# EAGLE design indsensor3 (EAGLE 7.1.0)
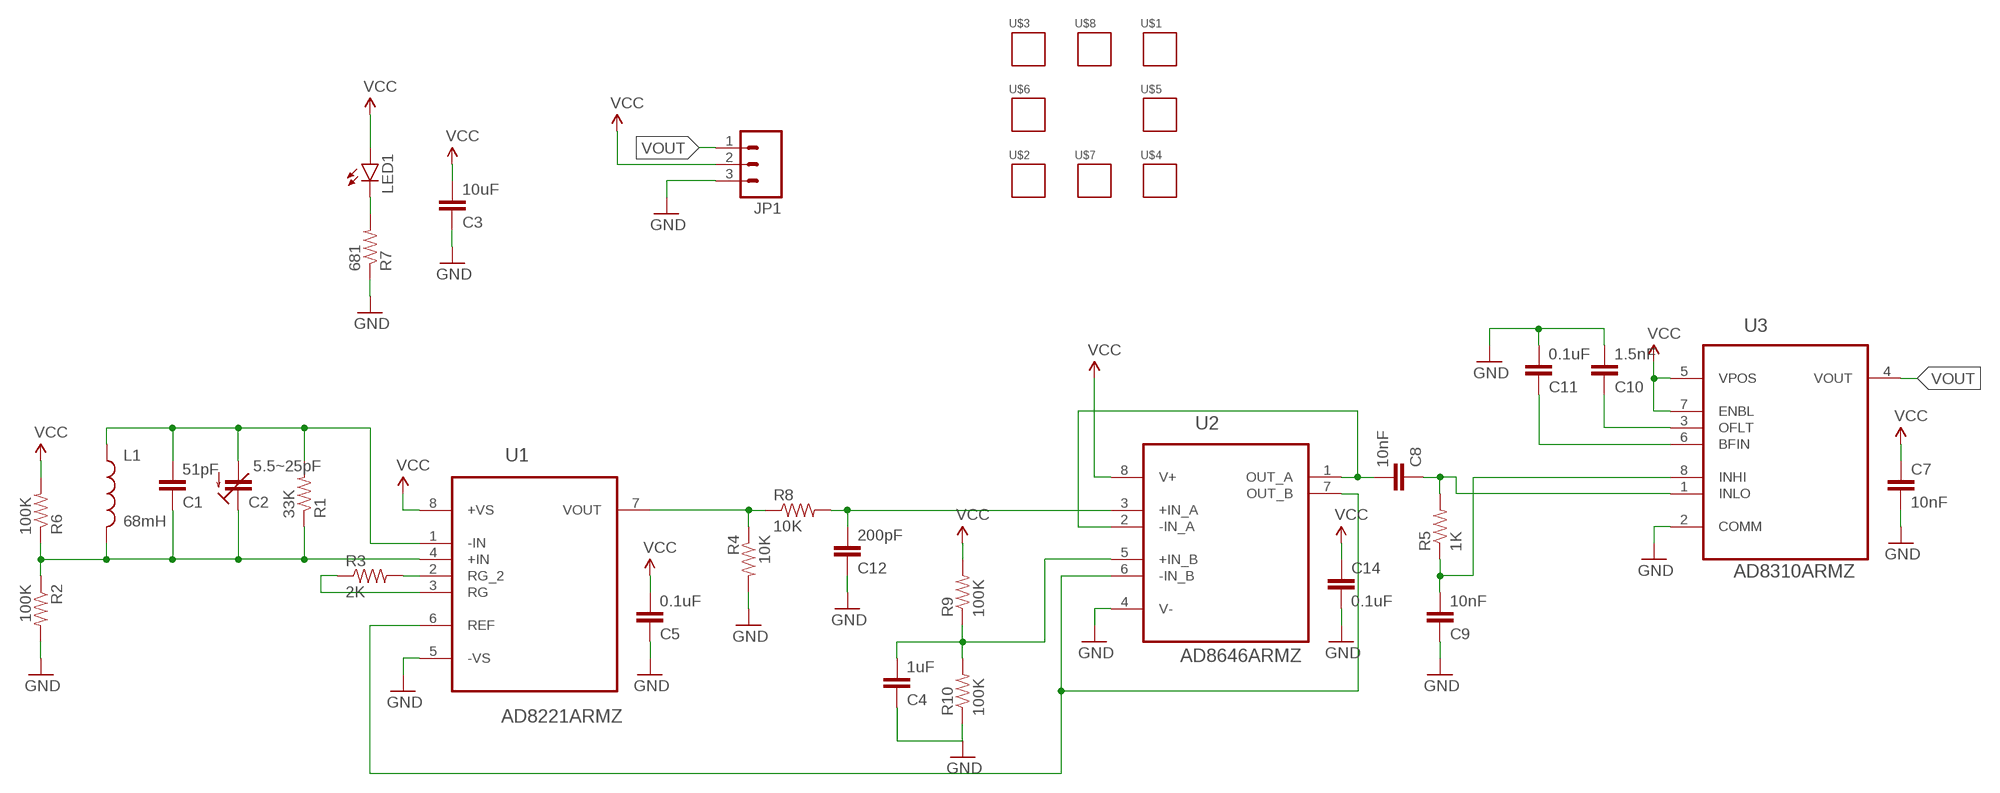
[diagram p0: schematic, sheet 1]

## Parts
C1  51pF  CAP0603-CAP  [0603-CAP]
C2  5.5~25pF  TRIMCAP-TZY  [TRIMCAP-TZY]
C3  10uF  CAP1206  [1206]
C4  1uF  CAP0603-CAP  [0603-CAP]
C5  0.1uF  CAP0603-CAP  [0603-CAP]
C7  10nF  CAP0603-CAP  [0603-CAP]
C8  10nF  CAP0603-CAP  [0603-CAP]
C9  10nF  CAP0603-CAP  [0603-CAP]
C10  1.5nF  CAP0603-CAP  [0603-CAP]
C11  0.1uF  CAP0603-CAP  [0603-CAP]
C12  200pF  CAP0603-CAP  [0603-CAP]
C14  0.1uF  CAP0603-CAP  [0603-CAP]
JP1  M03LOCK  [1X03_LOCK]
L1  68mH  INDUCTORRLB0912  [RLB0912]
LED1  LED0603  [LED-0603]
R1  33K  RESISTOR0603  [0603-RES]
R2  100K  RESISTOR0603  [0603-RES]
R3  2K  RESISTOR0603  [0603-RES]
R4  10K  RESISTOR0603  [0603-RES]
R5  1K  RESISTOR0603  [0603-RES]
R6  100K  RESISTOR0603  [0603-RES]
R7  681  RESISTOR0603  [0603-RES]
R8  10K  RESISTOR0603  [0603-RES]
R9  100K  RESISTOR0603  [0603-RES]
R10  100K  RESISTOR0603  [0603-RES]
U1  AD8221ARMZ  [SOP65P490X110-8N]
U2  AD8646ARMZ  [SOP65P490X110-8N]
U3  AD8310ARMZ  [SOP65P490X110-8N]
U$1  SHIELD-CORNER  [SHIELD-CORNER]
U$2  SHIELD-CORNER  [SHIELD-CORNER]
U$3  SHIELD-CORNER  [SHIELD-CORNER]
U$4  SHIELD-CORNER  [SHIELD-CORNER]
U$5  SHIELD-MIDDLE  [SHIELD-MIDDLE]
U$6  SHIELD-MIDDLE  [SHIELD-MIDDLE]
U$7  SHIELD-MIDDLEPART  [SHIELD-MIDDLEPART]
U$8  SHIELD-MIDDLE3  [SHIELD-MIDDLE3]

## Nets
10NF: R4.1 R8.1 U1.7(VOUT)
GND: C3.1 C4.1 C5.1 C7.2 C9.1 C10.2 C11.2 C12.1 C14.2 JP1.3 R2.2 R4.2 R7.1 R10.1 U1.5(-VS) U2.4(V-) U3.2(COMM)
N$1: R3.2 U1.2(RG_2)
N$2: R3.1 U1.3(RG)
N$3: C10.1 U3.3(OFLT)
N$4: C8.1 R5.2 U3.1(INLO)
N$5: C9.2 R5.1 U3.8(INHI)
N$6: LED1.C R7.2
N$7: C1.1 C2.2(E) L1.2 R1.1 R2.1 R6.1 U1.4(+IN)
N$8: C11.1 U3.6(BFIN)
N$9: C8.2 U2.1(OUT_A) U2.2(-IN_A)
N$10: C1.2 C2.1(A) L1.1 R1.2 U1.1(-IN)
N$11: C12.2 R8.2 U2.3(+IN_A)
N$12: U1.6(REF) U2.6(-IN_B) U2.7(OUT_B)
N$13: C4.2 R9.1 R10.2 U2.5(+IN_B)
VCC: C3.2 C5.2 C7.1 C14.1 JP1.2 LED1.A R6.2 R9.2 U1.8(+VS) U2.8(V+) U3.5(VPOS) U3.7(ENBL)
VOUT: JP1.1 U3.4(VOUT)

## Library data of the parts
C1 C4 C5 C7-C12 C14 = SparkFun-Capacitors:CAP: Capacitor Standard 0603 ceramic capacitor, and 0.1" leaded capacitor.
C2 = Custom:TRIMCAP-TZY
C3 = SparkFun-Passives:CAP: Capacitor Standard 0603 ceramic capacitor, and 0.1" leaded capacitor.
JP1 = SparkFun-Connectors:M03: Header 3 Standard 3-pin 0.1" header. Use with straight break away headers (SKU : PRT-00116), right angle break away headers (PRT-00553), swiss pins (PRT-00743), machine pins (PRT-00117), and female headers (PRT-00115). Molex polarized connector foot print use with SKU : PRT-08232 with associated crimp pins and housings.
L1 = SparkFun-Passives:INDUCTOR: Inductors Basic Inductor/Choke - 0603 and 1206. Footprints are not proven and vary greatly between part numbers. SRN6045- 33uH, 20% 1.4A SDR0403-560KL - 56uH, 10%, 500mA RMS/740mA peak
LED1 = SparkFun-LED:LED: LEDs Standard schematic elements and footprints for 5mm, 3mm, 1206, and 0603 sized LEDs. 5mm - Spark Fun Electronics SKU : COM-00529 (and others)
R1-R10 = SparkFun-Resistors:RESISTOR: Resistor Basic schematic elements and footprints for 0603, 1206, and PTH resistors.
U1 = Analog Devices_By_element14_Batch_1:AD8221ARMZ: Precision Instrumentation Amplifier; MPN: AD8221ARMZ; OC_FARNELL: 1581948; OC_NEWARK: 19M0946; PACKAGE: MSOP-8; SUPPLIER: Analog Devices
U2 = ADI-Phase-2:AD8646ARMZ: Rail-to-Rail Amplifiers; MPN: AD8646ARMZ; OC_FARNELL: 2094200; OC_NEWARK: 34P3249; PACKAGE: MSOP-8; SUPPLIER: Analog Devices
U3 = ADI-Phase-2:AD8310ARMZ: 95 dB Logarithmic Amplifier; MPN: AD8310ARMZ; OC_FARNELL: 1661042; OC_NEWARK: 59K6572; PACKAGE: MSOP-8; SUPPLIER: Analog Devices
U$1-U$4 = Custom:SHIELD-CORNER
U$5 U$6 = Custom:SHIELD-MIDDLE
U$7 = Custom:SHIELD-MIDDLEPART
U$8 = Custom:SHIELD-MIDDLE3

## Board
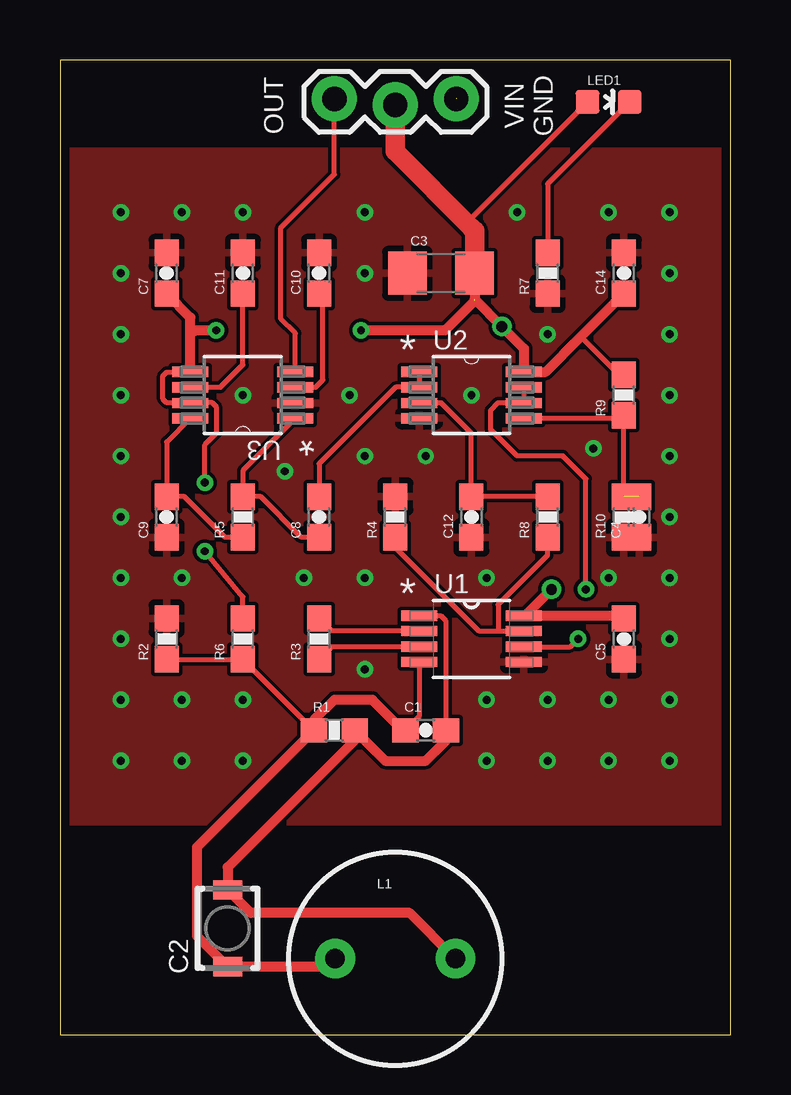
[diagram p1: board, top side]
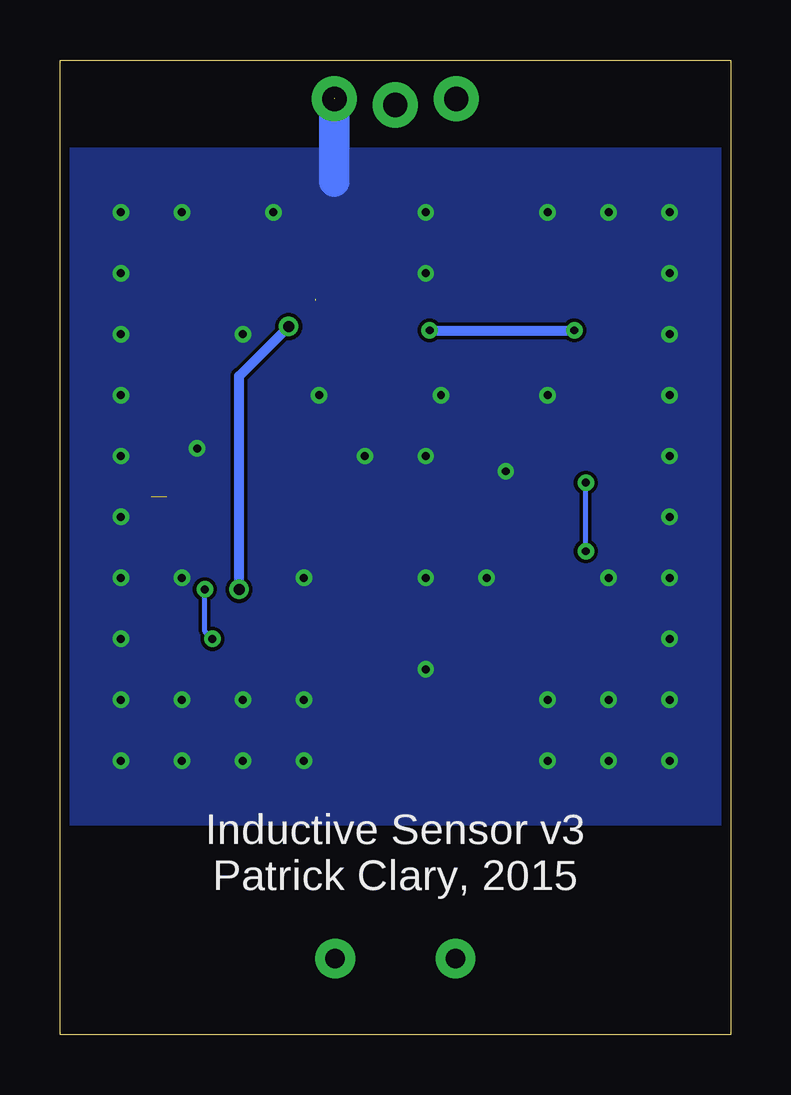
[diagram p2: board, bottom side, seen from below]

Size 27.94 x 40.64 mm. Coordinates in mm from the lower left corner, seen from the top.
Outline: 0,0 27.94,0 27.94,40.64 0,40.64 0,0
Copper layers (1*16): Top 0.0356mm / dielectric 1.5011mm / Bottom 0.0356mm
Design rules "LaenPCBOrder": minimum track width 6mil, minimum drill 13mil, track to track 6mil, track to pad 6mil, pad to pad 6mil, via to via 6mil, smd to smd 6mil, copper to edge 15mil, drill to drill 6mil, minimum pad ring 7mil, minimum via ring 7mil, stop-mask expansion 3mil, vias tented up to drill 0mil, thermal gap 10mil

### Footprints (pad centres in the part's own frame; a part is rotated, then mirrored left to right if it is on the bottom)
0603-CAP = smd 1.1 x 1: 1 -0.85,0; 2 0.85,0
TRIMCAP-TZY = smd 1.2 x 0.8: 1 0,1.6; 2 0,-1.6
1206 = smd 1.6 x 1.8: 1 -1.4,0; 2 1.4,0
1X03_LOCK = drill 1.016 pad 1.88: 1 0,0.127; 2 2.54,-0.127; 3 5.08,0.127
RLB0912 = drill 0.813 pad 1.651: 1 2.502,0; 2 -2.502,0
LED-0603 = smd 1 x 1: A 0,-0.877; C 0,0.877
0603-RES = smd 1.1 x 1: 1 -0.85,0; 2 0.85,0
SOP65P490X110-8N = smd 1.499 x 0.432: 1 -2.184,0.965; 2 -2.184,0.33; 3 -2.184,-0.33; 4 -2.184,-0.965; 5 2.184,-0.965; 6 2.184,-0.33; 7 2.184,0.33; 8 2.184,0.965

### Placement (x,y rotation side)
C1  15.24,12.7 0 top
C2  6.99,4.45 0 top
C3  15.88,31.75 0 top
C4  24.13,21.59 90 top
C5  23.5,16.51 90 top
C7  4.45,31.75 90 top
C8  10.79,21.59 90 top
C9  4.45,21.59 90 top
C10  10.79,31.75 90 top
C11  7.62,31.75 90 top
C12  17.14,21.59 90 top
C14  23.5,31.75 90 top
JP1  11.43,38.89 0 top
L1  13.97,3.17 0 top
LED1  22.86,38.89 270 top
R1  11.43,12.7 0 top
R2  4.45,16.51 90 top
R3  5K  [0603-RES]  10.79,16.51 90 top
R4  13.97,21.59 90 top
R5  7.62,21.59 90 top
R6  7.62,16.51 90 top
R7  20.32,31.75 90 top
R8  20.32,21.59 90 top
R9  23.5,26.67 90 top
R10  23.5,21.59 90 top
U1  17.14,16.51 0 top
U2  17.14,26.67 0 top
U3  7.62,26.67 180 top
U$1  13.97,22.86 0 top
U$2  13.97,22.86 180 top
U$3  13.97,22.86 90 top
U$4  13.97,22.86 270 top
U$5  13.97,22.86 0 top
U$6  13.97,22.86 180 top
U$7  13.97,22.86 270 top
U$8  13.97,22.86 90 top

### Tracks (layer width: path | path; a pad name or v marks a point on that pad's centre or on a via)
10NF
  Top 0.203: R8.1 20.32,20 18.26,17.94 18.26,16.84 | 18.26,16.84 U1.7 | R4.1 13.97,20.32 17.45,16.84 18.26,16.84
GND  (via drill 0.33)  (1 unrouted)
  Bottom 1.27: 16.51,39.05 16.51,35.56
  other vias: 12.7,24.13 15.24,24.13 12.7,19.05 10.16,19.05 2.54,26.67 12.7,15.24 17.78,19.05 17.78,13.97 20.32,13.97 22.86,13.97 7.62,13.97 5.08,13.97 5.08,19.05 12.7,31.75 20.32,29.21 7.62,26.67 22.86,19.05 9.37,23.5 22.23,24.45 17.14,26.67 2.54,11.43 5.08,11.43 7.62,11.43 2.54,13.97 2.54,16.51 2.54,19.05 2.54,21.59 2.54,24.13 12.06,26.67 2.54,29.21 2.54,31.75 2.54,34.29 5.08,34.29 7.62,34.29 12.7,34.29 25.4,34.29 25.4,31.75 25.4,29.21 25.4,26.67 25.4,24.13 25.4,21.59 25.4,19.05 25.4,16.51 25.4,13.97 25.4,11.43 22.86,11.43 20.32,11.43 17.78,11.43 22.86,34.29 19.05,34.29
  pour Bottom: 0,8.89 27.94,8.89 27.94,36.83 0,36.83
  pour Top: 0,8.89 27.94,8.89 27.94,36.83 0,36.83
N$1
  Top 0.203: U1.2 11.31,16.84 R3.2
N$2
  Top 0.203: U1.3 11.31,16.18 R3.1
N$3
  Top 0.203: U3.3 10.65,27 10.95,27.3 10.95,30.74 C10.1
N$4
  Top 0.203: C8.1 10.06,20.74 8.36,22.44 R5.2 7.62,23.52 U3.1
N$5
  Top 0.203: R5.1 6.88,20.74 5.18,22.44 C9.2 4.45,24.71 U3.8
N$6
  Top 0.203: LED1.C 20.32,35.48 R7.2
N$7
  Top 0.203: U1.4 14.96,13.27 C1.1 | R2.1 R6.1 R1.1
  Top 0.406: C1.1 14.29,12.7 13.02,13.97 11.43,13.97 10.58,13.12 R1.1 5.71,7.83 5.71,4.12 C2.2 11.14,2.85 L1.2
N$8
  Top 0.203: U3.6 6.68,27 7.62,27.94 C11.1
N$9
  Top 0.203: U2.1 U2.2 13.98,27 10.79,23.81 C8.2
N$10
  Top 0.203: C1.2 16.09,17.25 15.88,17.46 14.97,17.46 U1.1
  Top 0.406: 12.28,12.61 R1.2 | R1.2 12.28,12.28 6.99,6.99 C2.1 | 6.99,6.35 C2.1 | R1.2 13.55,11.43 15.24,11.43 16.09,12.28 C1.2 | L1.1 14.57,5.08 7.95,5.08 C2.1
N$11
  Top 0.203: U2.3 15.89,26.34 17.14,25.08 C12.2 R8.2
N$12  (via drill 0.33)
  Top 0.203: U1.6 21.26,16.18 v21.59,16.51 | v21.91,18.57 21.91,23.18 20.95,24.13 19.05,24.13 17.94,25.24 17.94,26.04 18.26,26.35 19.32,26.35 U2.6 U2.7
  Bottom 0.203: v21.59,16.51 21.91,16.83 v21.91,18.57
N$13  (1 unrouted)
  Top 0.203: R10.2 R9.1 23.38,25.7 U2.5
VCC  (via drill 0.33, 0.46)  (1 unrouted)
  Top 0.203: U3.5 5.42,27.62 4.45,27.62 4.29,27.46 4.29,26.51 4.46,26.34 U3.7 5.45,26.35 6.35,26.35 6.51,26.19 6.51,25.08 6.03,24.61 v6.03,23.02 | R9.2 23.28,27.52 21.7,29.1 | R6.2 7.62,18.26 v6.03,20.16 | LED1.A 17.14,34.06 17.14,33.66
  Top 0.406: C5.2 23.38,17.48 U1.8 19.38,17.48 v20.48,18.57 | C14.1 21.7,29.1 20.23,27.64 U2.8 19.33,28.61 v18.41,29.53 17.27,30.67 | U3.5 5.44,29.21 | 5.44,29.21 5.44,29.91 C7.1 | C3.2 17.27,30.61 16.03,29.37 v12.54,29.37 | v6.51,29.37 5.59,29.37 5.44,29.21
  Top 0.813: JP1.2 13.97,36.83 17.14,33.66 17.27,33.52 C3.2
  Bottom 0.203: v6.03,20.16 v6.03,23.02
  Bottom 0.406: v20.48,18.57 20.48,27.46 v18.41,29.53 | v12.54,29.37 v6.51,29.37
VOUT
  Top 0.203: U3.4 9.8,29.25 9.21,29.84 9.21,33.66 11.43,35.88 JP1.1

### Text on the board
tPlace: OUT | VIN / GND
bPlace: Inductive Sensor v3 / Patrick Clary, 2015